# Altium schematic sheet UART_DEBUG.SchDoc
size A3
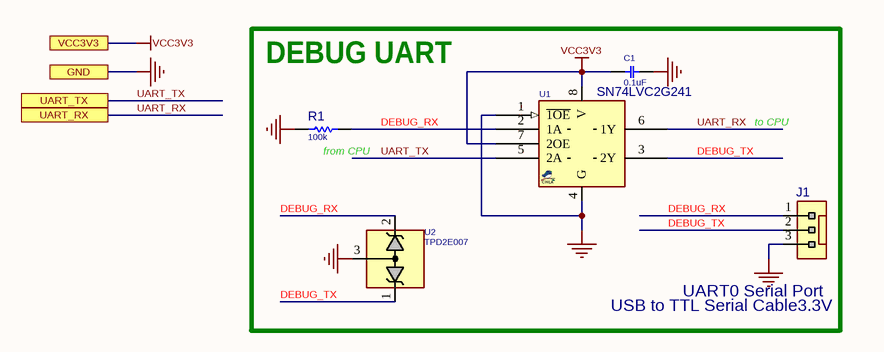
[diagram p0: UART_DEBUG.SchDoc]

## Parts
C1  0.1uF  [C0402]
J1  HDRWF_3  [WF_3]  (value not drawn)
R1  100k  [R0402]
U1  SN74LVC2G241  [SOG50_8]
U2  TPD2E007  [SOT663_3]

## Ports
GND, UART_RX, UART_TX, VCC3V3

## Nets
GND: C1.2 J1.3 R1.1 U1.1(~{1OE}) U1.4(G) U2.3(GND) ; port GND
VCC3V3: C1.1 U1.7(2OE) U1.8(V) ; port VCC3V3
DEBUG_RX: J1.1 R1.2 U1.2(1A) U2.2(IO2)
DEBUG_TX: J1.2 U1.3(2Y) U2.1(IO1)
UART_RX: U1.6(1Y) ; port UART_RX
UART_TX: U1.5(2A) ; port UART_TX

## Notes on the sheet
- DEBUG UART
- to CPU
- (near R1) from CPU
- (near J1) USB to TTL Serial Cable3.3V
- (near J1) UART0 Serial Port

## Library data of the parts
C1 = CAP_SMD_MLCC_100n50TDK: CAP, MLCC; PARAM: X7R, 10%, -55~125oC; MANF_P#: GRM155R71H104KE14D; MANF: Murata; PARAM2: 50v; ASSEMBLY: ASSEMBLY; PRICE: 100: 0.018$; VALUE: 0.1uF
J1 = HDRWF_3: Header, WF, Pitch: 2.54mm; VALUE: HDRWF_3
R1 = RES_SMD_100K_0402YK: RESISTOR, SMD, THICK FILM, YAGEO; PARAM: 0.063W; DESC: DESCRIPTION; DIST#: MOUSER; PARAM2: 1%; MANF_P#: -; MANF: -; ASSEMBLY: ASSEMBLY; PRICE: 100= 0.3$; VALUE: 100k
U1 = SN74LVC2G241: Buffer/Line Driver, Dual, 3-State Outputs; MANF: Texas Instruments; MANF_P#: SN74LVC2G241DCU; VALUE: SN74LVC2G241
U2 = TVS_X2_TPD2E007: TVS, ESD PROTECT, 2CH, 14VBR, 0.2W; MANF_P#: TPD2E007DCKR; MANF: TI; PARAM: 14VBR, -40~85oC; PRICE: 0.6$; VALUE: TPD2E007